# EAGLE schematic Transmitter (EAGLE 6.4)
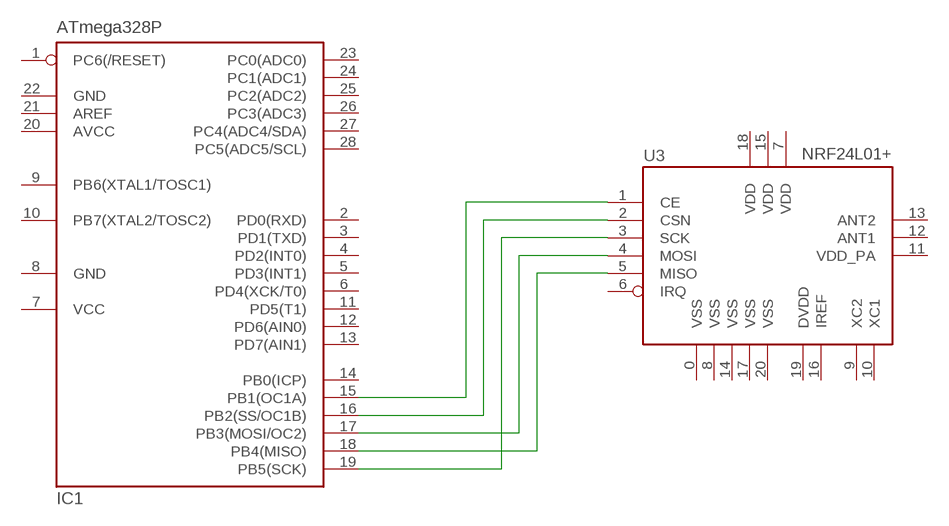
[diagram p0: schematic, sheet 1]

## Parts
IC1  ATmega328P  MEGA8-P  [DIL28-3]
U3  NRF24L01+  NRF24L01SMD  [QFN20]

## Nets
N$1: IC1.15(PB1(OC1A)) U3.1(CE)
N$2: IC1.16(PB2(SS/OC1B)) U3.2(CSN)
N$3: IC1.19(PB5(SCK)) U3.3(SCK)
N$4: IC1.17(PB3(MOSI/OC2)) U3.4(MOSI)
N$5: IC1.18(PB4(MISO)) U3.5(MISO)
Unconnected: IC1.1(PC6(/RESET)) IC1.2(PD0(RXD)) IC1.3(PD1(TXD)) IC1.4(PD2(INT0)) IC1.5(PD3(INT1)) IC1.6(PD4(XCK/T0)) IC1.9(PB6(XTAL1/TOSC1)) IC1.10(PB7(XTAL2/TOSC2)) IC1.11(PD5(T1)) IC1.12(PD6(AIN0)) IC1.13(PD7(AIN1)) IC1.14(PB0(ICP)) IC1.21(AREF) IC1.23(PC0(ADC0)) IC1.24(PC1(ADC1)) IC1.25(PC2(ADC2)) IC1.26(PC3(ADC3)) IC1.27(PC4(ADC4/SDA)) IC1.28(PC5(ADC5/SCL)) U3.6(IRQ) U3.9(XC2) U3.10(XC1) U3.12(ANT1) U3.13(ANT2) U3.16(IREF)

## Power pins joined to a net without a drawn wire
AVCC: IC1.20(AVCC)
DVDD: U3.19(DVDD)
GND: IC1.8(GND) IC1.22(GND)
VCC: IC1.7(VCC)
VDD: U3.7(VDD) U3.15(VDD) U3.18(VDD)
VDD_PA: U3.11(VDD_PA)
VSS: U3.0(VSS) U3.8(VSS) U3.14(VSS) U3.17(VSS) U3.20(VSS)

## Library data of the parts
IC1 = atmel:MEGA8-P: MICROCONTROLLER 8 Kbytes FLASH, 1 kbytes SRAM, 512 bytes EEPROM, USART, 4-channel 10 bit ADC, 2-channel 8 bit ADC Pin compatible with Atmega48, ATMega88, ATMega168 Source: avr.lbr; OC_FARNELL: unknown; OC_NEWARK: unknown
U3 = SparkFun:NRF24L01: 2.4GHz Low Power Transceiver This is the very popular, low cost, very low power RF transceiver from Nordic Semiconductor. Simple SPI interface. SKU: COM-00690